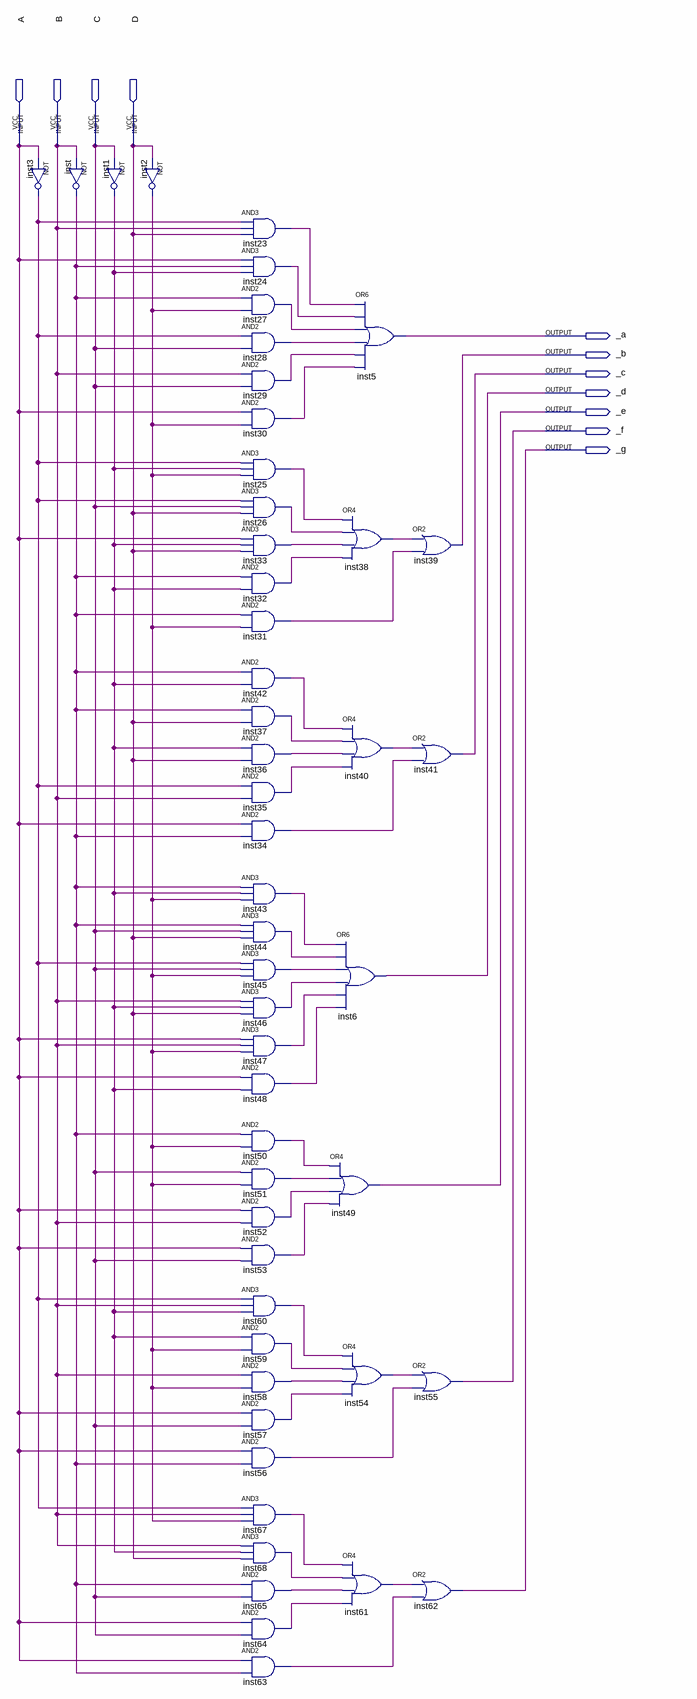
[diagram p0: schematic sheet]
// Quartus schematic binariohexadecimal4bit.bdf as structural Verilog: 51 symbols, 11 pins
module binariohexadecimal4bit (
  input  A,
  input  B,
  input  C,
  input  D,
  output _a,
  output _b,
  output _c,
  output _d,
  output _e,
  output _f,
  output _g
);

  wire inst1_out, inst2_out, inst3_out, inst23_out, inst24_out, inst25_out, inst26_out, inst27_out,
       inst28_out, inst29_out, inst30_out, inst31_out, inst32_out, inst33_out, inst34_out, inst35_out,
       inst36_out, inst37_out, inst38_out, inst40_out, inst42_out, inst43_out, inst44_out, inst45_out,
       inst46_out, inst47_out, inst48_out, inst50_out, inst51_out, inst52_out, inst53_out, inst54_out,
       inst56_out, inst57_out, inst58_out, inst59_out, inst60_out, inst61_out, inst63_out, inst64_out,
       inst65_out, inst67_out, inst68_out, inst_out;

  not inst3 (inst3_out, A);
  not inst (inst_out, B);
  not inst1 (inst1_out, C);
  not inst2 (inst2_out, D);
  and inst23 (inst23_out, inst3_out, B, D);
  and inst24 (inst24_out, A, inst_out, inst1_out);
  and inst27 (inst27_out, inst_out, inst2_out);
  and inst28 (inst28_out, inst3_out, C);
  and inst29 (inst29_out, B, C);
  and inst30 (inst30_out, A, inst2_out);
  and inst25 (inst25_out, inst3_out, inst1_out, inst2_out);
  and inst26 (inst26_out, inst3_out, C, D);
  and inst33 (inst33_out, A, inst1_out, D);
  and inst32 (inst32_out, inst_out, inst1_out);
  and inst31 (inst31_out, inst_out, inst2_out);
  and inst42 (inst42_out, inst_out, inst1_out);
  and inst37 (inst37_out, inst_out, D);
  and inst36 (inst36_out, inst1_out, D);
  and inst35 (inst35_out, inst3_out, B);
  and inst34 (inst34_out, A, inst_out);
  and inst43 (inst43_out, inst_out, inst1_out, inst2_out);
  and inst44 (inst44_out, inst_out, C, D);
  and inst45 (inst45_out, inst3_out, C, inst2_out);
  and inst46 (inst46_out, B, inst1_out, D);
  and inst47 (inst47_out, A, B, inst2_out);
  and inst48 (inst48_out, A, inst1_out);
  and inst50 (inst50_out, inst_out, inst2_out);
  and inst51 (inst51_out, C, inst2_out);
  and inst52 (inst52_out, A, B);
  and inst53 (inst53_out, A, C);
  and inst60 (inst60_out, inst3_out, B, inst1_out);
  and inst59 (inst59_out, inst1_out, inst2_out);
  and inst58 (inst58_out, B, inst2_out);
  and inst57 (inst57_out, A, C);
  and inst56 (inst56_out, A, inst_out);
  and inst67 (inst67_out, inst3_out, B, inst2_out);
  and inst68 (inst68_out, B, inst1_out, D);
  and inst65 (inst65_out, inst_out, C);
  and inst64 (inst64_out, A, C);
  and inst63 (inst63_out, A, inst_out);
  or inst5 (_a, inst23_out, inst24_out, inst27_out, inst28_out, inst29_out, inst30_out);
  or inst38 (inst38_out, inst25_out, inst26_out, inst33_out, inst32_out);
  or inst40 (inst40_out, inst42_out, inst37_out, inst36_out, inst35_out);
  or inst6 (_d, inst43_out, inst44_out, inst45_out, inst46_out, inst47_out, inst48_out);
  or inst49 (_e, inst50_out, inst51_out, inst52_out, inst53_out);
  or inst54 (inst54_out, inst60_out, inst59_out, inst58_out, inst57_out);
  or inst61 (inst61_out, inst67_out, inst68_out, inst65_out, inst64_out);
  or inst39 (_b, inst38_out, inst31_out);
  or inst41 (_c, inst40_out, inst34_out);
  or inst55 (_f, inst54_out, inst56_out);
  or inst62 (_g, inst61_out, inst63_out);
endmodule
